# Altium project PIR Sensor driver v3.PrjPcb
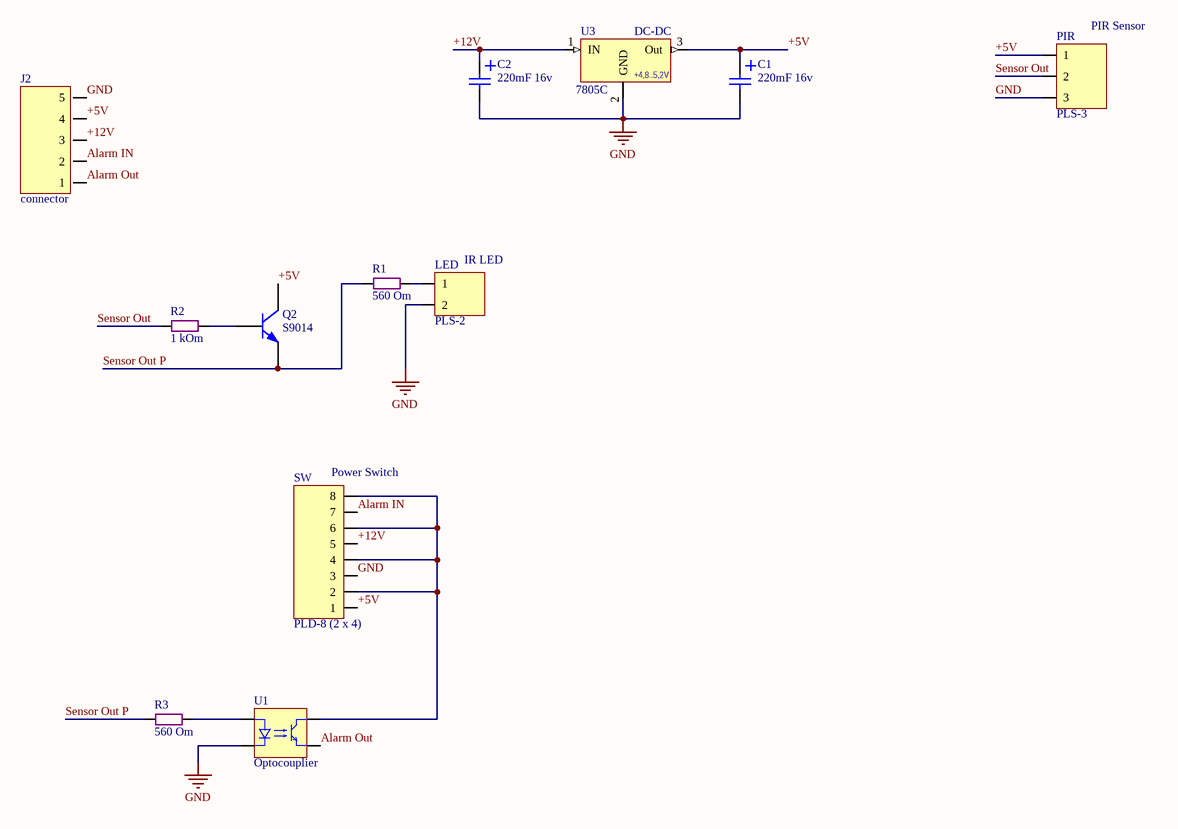
[diagram p0: PIR Sensor driver v3.SchDoc]
1 sheet, 12 parts. Net scope: global (net labels, ports and power ports of the same name join across sheets).
Board file: PIR Sensor driver v3.PcbDoc

## Sheet PIR Sensor driver v3.SchDoc
size A4

### Parts
C1  220mF 16v  [Cap E p4mm D6.5xH11]
C2  220mF 16v  [Cap E p2mm D6.5xH11]
J2  connector  [Line 2.54 x 5 - (D2mm)]
LED  PLS-2  [Line 2.54 x 2]
PIR  PLS-3  [Line 2.54 X 3]
Q2  S9014  [TO-92 2.54 (EBC)]
R1  560 Om  [SMD 0805 (2012)]
R2  1 kOm  [SMD 0805 (2012)]
R3  560 Om  [SMD 0805 (2012)]
SW  PLD-8 (2 x 4)  [Line 2.54 X 8D (2 x 4)]
U1  Optocouplier  [DIP-4]
U3  7805C  V Out: +4,8..5,2V  [D-PAK]

### Nets
GND: C1.2 C2.2 J2.5 LED.2 PIR.3 SW.3 U1.2 U3.2(GND)
+5V: C1.1 J2.4 PIR.1 Q2.C SW.1 U3.3(Out)
+12V: C2.1 J2.3 SW.5 U3.1(IN)
Alarm IN: J2.2 SW.7
Alarm Out: J2.1 U1.4
Sensor Out: PIR.2 R2.1
Sensor Out P: Q2.E R1.1 R3.1
NetLED_1: LED.1 R1.2
NetQ2_B: Q2.B R2.2
NetR3_2: R3.2 U1.1
NetSW_2: SW.2 SW.4 SW.6 SW.8 U1.3

### Notes on the sheet
- (near U3) DC-DC
- (near PIR) PIR Sensor
- (near LED) IR LED
- (near SW) Power Switch

### Library data of the parts
C1 C2 = Cap E 220mF x 16V: Capacitor; Value: 220mF 16v
J2 = PLS-5: Vert, Sgl line, Male
LED = PLS-2: Vert, Sgl line, Male
PIR = PLS-3: Vert, Sgl line, Male
Q2 = S9014: NPN Bipolar Transistor; Published: 8-Jun-2000; LatestRevisionNote: Re-released for DXP Platform.; PackageReference: TO-226-AA; Publisher: Altium Limited; PackageDescription: TO, Flat Index; 3 In-Line, Axial Leads; Body Dia. 4.8mm; Leads 0.55 x 0.51 mm (max)
R1-R3 = Res SMD 0805
SW = PLD-8 (2 x 4): Vert, Sgl line, Male
U1 = Optocouplier LTV 817B: LTV817 Datasheet: http://lib.chipdip.ru/222/DOC000222300.pdf; Name: LTV817B
U3 = 7805C: Voltage Regulator; Manufacturer: Интеграл; I output (A): 1; Max Voltage In (V): 35; Напряжение выход-вход (dropout): >2V; t: -10..+70°C; Case: D2PAK; Shema: http://tec.org.ru/_bd/5/57349922.jpg; Name: 7805C